# Altium schematic sheet PROC099A_XDS110 Interface_1B.SchDoc: XDS110 Interface_1B
size 431 x 279 mm; Date: Not shown in title block; ApprovedBy: Not shown in title block; CheckedBy: Not shown in title block; Author: Not shown in title block; CompanyName: Not shown in title block; DrawnBy: Adrian Ozer; Engineer: Not shown in title block; Organization: Not shown in title block; Address1: Not shown in title block; Address2: Not shown in title block; Address3: Not shown in title block; Address4: Not shown in title block; DocumentNumber: 13; Revision: Use project parameter SCH_Rev; SheetNumber: 13; SheetTotal: 16; PageSetup: Record=PageOptions|CenterHorizontal=True|CenterVertical=True|PrintScale=1.00|XCorrection=1.00|YCorrection=1.00|PrintKind=0|BorderSize=5000000|LeftOffset=0|BottomOffset=0|Orientation=2|PaperLength=1000|PaperWidth=1000|Scale=100|PaperSource=15|PrintQuality=600|MediaType=1|DitherType=10|PaperKind=Letter|PrintScaleMode=1; CurrentTime: Not shown in title block; CurrentDate: Not shown in title block; Time: Not shown in title block; DocumentFullPathAndName: Not shown in title block; DocumentName: Not shown in title block; ModifiedDate: Not shown in title block; ImagePath: Not shown in title block
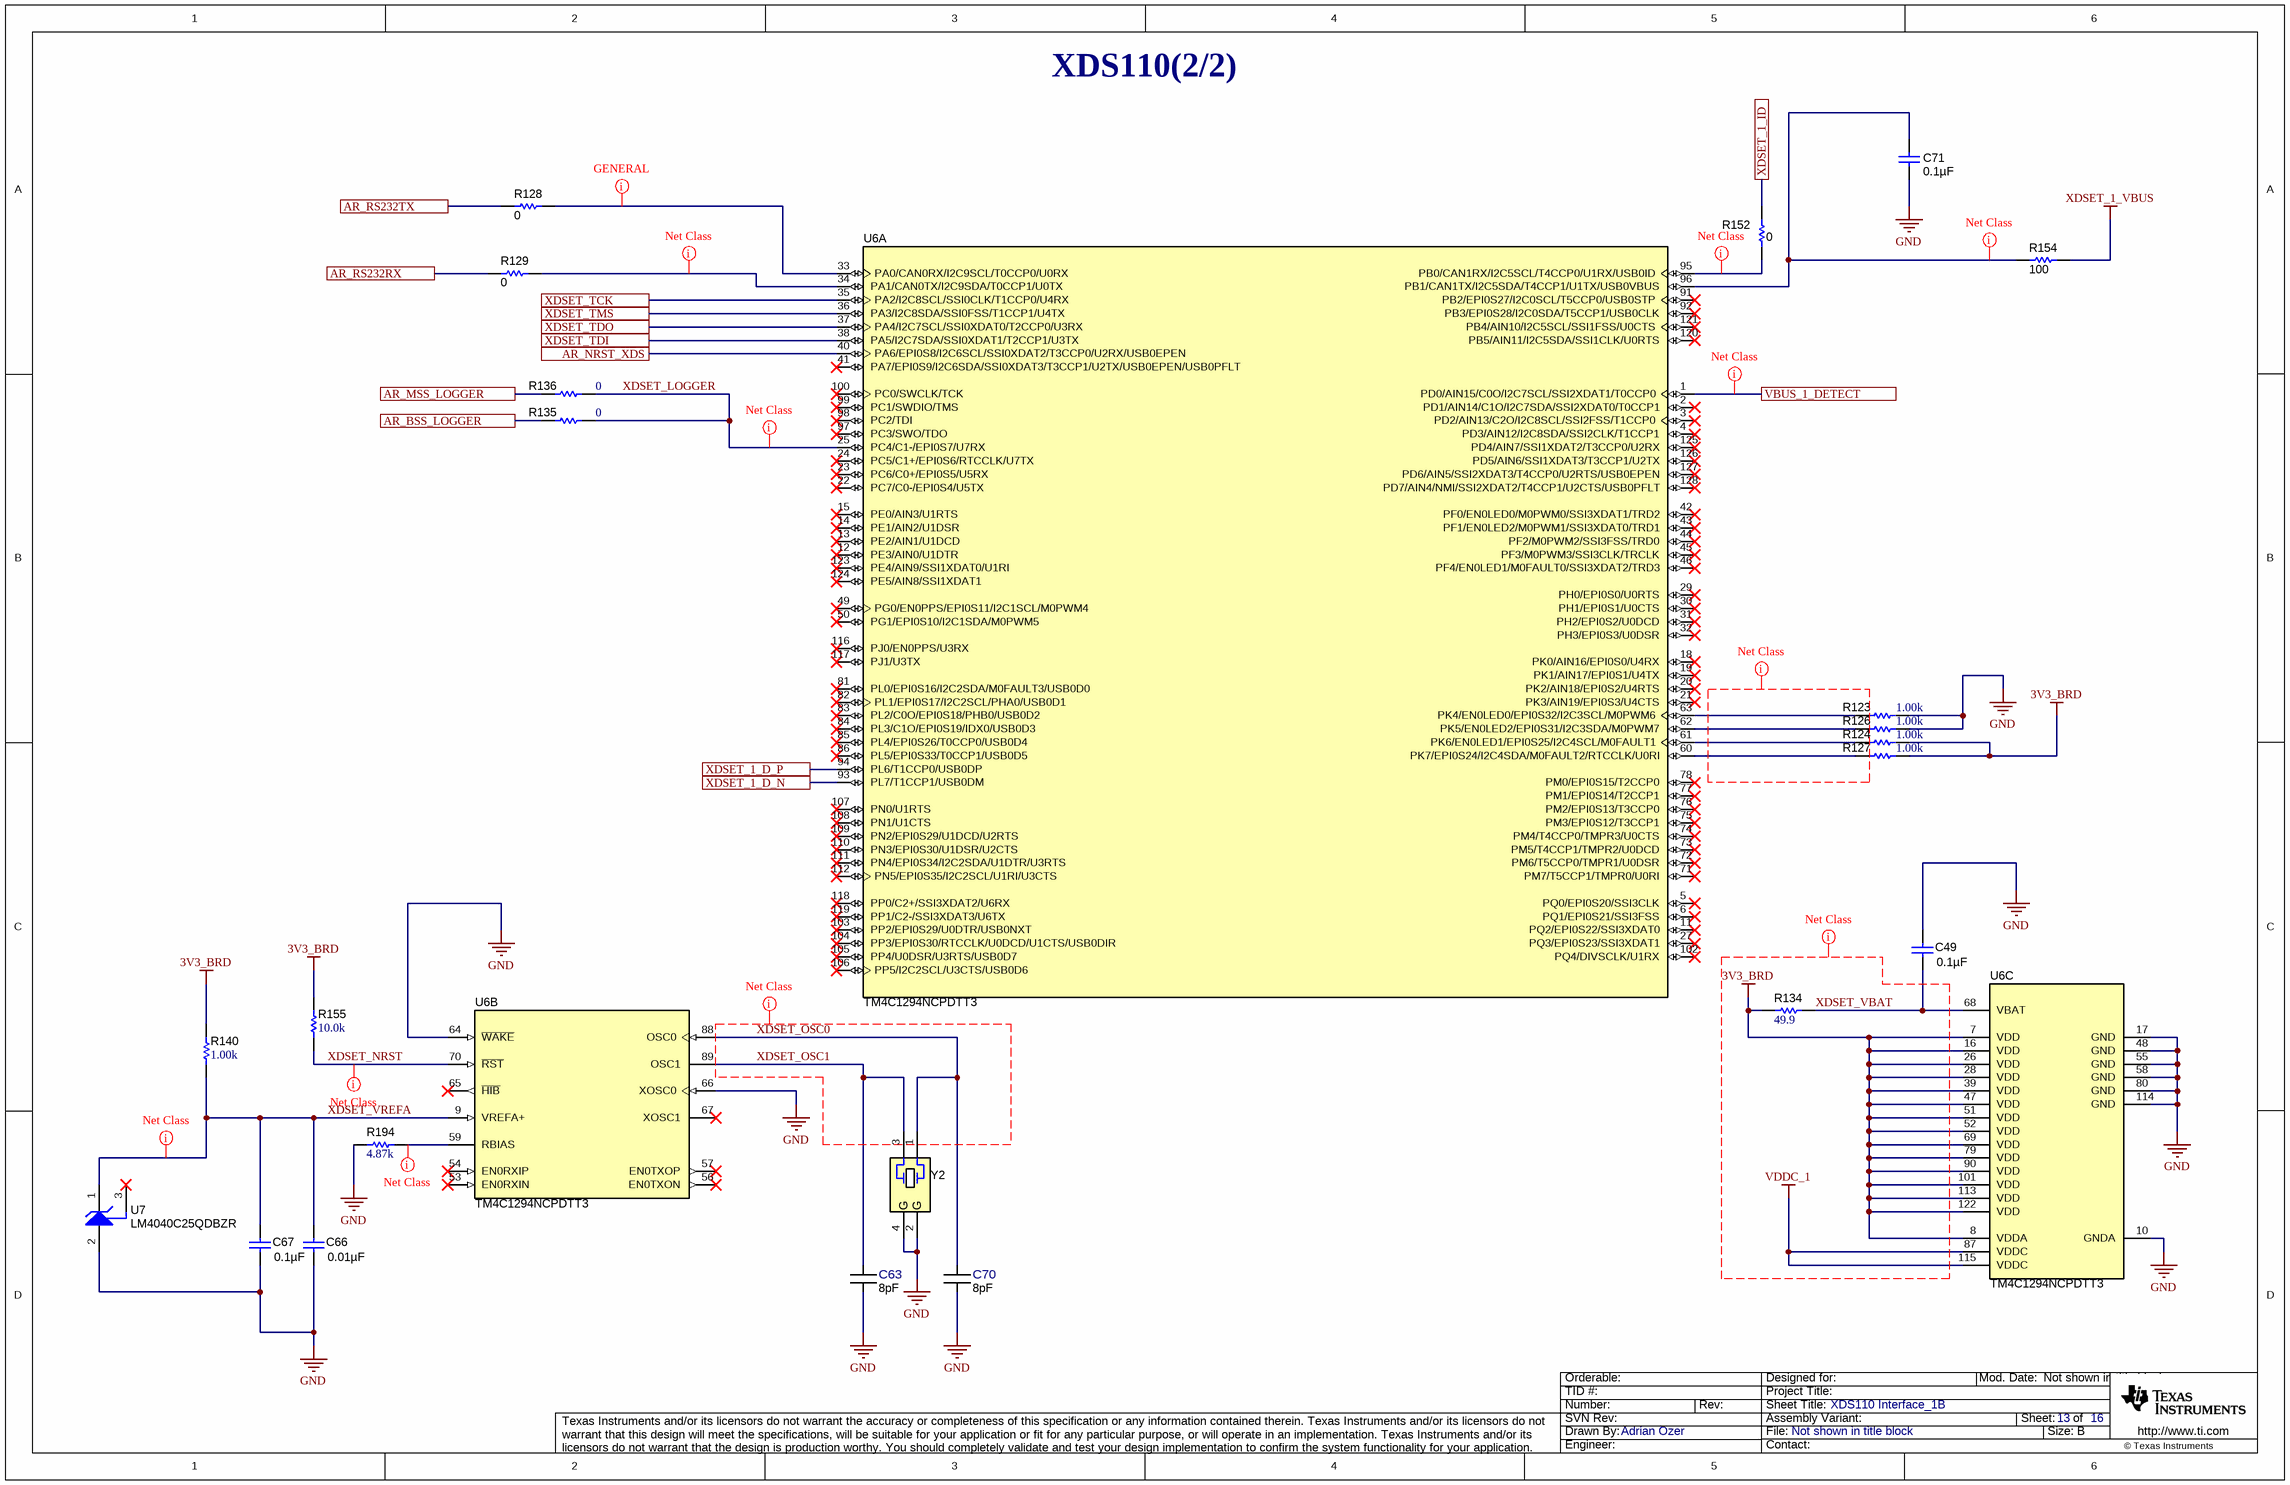
[diagram p0: PROC099A_XDS110 Interface_1B.SchDoc]

## Parts
C49  ValueDisplayed: 0.1µF  [0402L]  (hidden comment: C0402C104K8RACTU)
C63  Cap_F: 8pF  [FP-GCM1555C1H8R0DA16_0402-MFG]  (hidden comment: GCM1555C1H8R0DA16D)
C66  ValueDisplayed: 0.01µF  [0402L]  (hidden comment: C0402C103K4RACTU)
C67  ValueDisplayed: 0.1µF  [0402L]  (hidden comment: C0402C104K8RACTU)
C70  Cap_F: 8pF  [FP-GCM1555C1H8R0DA16_0402-MFG]  (hidden comment: GCM1555C1H8R0DA16D)
C71  ValueDisplayed: 0.1µF  [0402L]  (hidden comment: C0402C104K8RACTU)
R123  ValueDisplayed: 1.00k  [0402L]  (hidden comment: CRCW04021K00FKED)
R124  ValueDisplayed: 1.00k  [0402L]  (hidden comment: CRCW04021K00FKED)
R126  ValueDisplayed: 1.00k  [0402L]  (hidden comment: CRCW04021K00FKED)
R127  ValueDisplayed: 1.00k  [0402L]  (hidden comment: CRCW04021K00FKED)
R128  ValueDisplayed: 0  [0402L]  (hidden comment: ERJ-2GE0R00X)
R129  ValueDisplayed: 0  [0402L]  (hidden comment: ERJ-2GE0R00X)
R134  ValueDisplayed: 49.9  [0402L]  (hidden comment: CRCW040249R9FKED)
R135  ValueDisplayed: 0  [0201_Silk]  (hidden comment: CRCW02010000Z0ED)
R136  ValueDisplayed: 0  [0201_Silk]  (hidden comment: CRCW02010000Z0ED)
R140  ValueDisplayed: 1.00k  [0402L]  (hidden comment: CRCW04021K00FKED)
R152  ValueDisplayed: 0  [0402L]  (hidden comment: ERJ-2GE0R00X)
R154  ValueDisplayed: 100  [0402L]  (hidden comment: ERJ-2GEJ101X)
R155  ValueDisplayed: 10.0k  [0402L]  (hidden comment: CRCW040210K0FKED)
R194  ValueDisplayed: 4.87k  [0402L]  (hidden comment: CRCW04024K87FKED)
U6  TM4C1294NCPDTT3  [PDT0128A]  (parts A,B,C of 3)
U7  LM4040C25QDBZR  [DBZ0003A_N]
Y2  NX3225SA-16.000M-STD-CRS-2  [NDK_NX3225SA]  (value not drawn)

## Ports
AR_BSS_LOGGER, AR_MSS_LOGGER, AR_NRST_XDS, AR_RS232RX, AR_RS232TX, VBUS_1_DETECT, XDSET_1_D_N, XDSET_1_D_P, XDSET_1_ID, XDSET_TCK, XDSET_TDI, XDSET_TDO, XDSET_TMS

## Nets
3V3_BRD: R124.2 R127.2 R134.2 R140.2 R155.2 U6.7(VDD) U6.8(VDDA) U6.16(VDD) U6.26(VDD) U6.28(VDD) U6.39(VDD) U6.47(VDD) U6.51(VDD) U6.52(VDD) U6.69(VDD) U6.79(VDD) U6.90(VDD) U6.101(VDD) U6.113(VDD) U6.122(VDD)
GND: C49.1 C63.2 C66.1 C67.1 C70.2 C71.1 R123.2 R126.2 R194.1 U6.10(GNDA) U6.17(GND) U6.48(GND) U6.55(GND) U6.58(GND) U6.64(~{WAKE}) U6.66(XOSC0) U6.80(GND) U6.114(GND) U7.2(ANODE) Y2.2(GND) Y2.4(GND)
VDDC_1: U6.87(VDDC) U6.115(VDDC)
XDSET_1_VBUS: R154.2
AR_BSS_LOGGER: R135.1 ; port AR_BSS_LOGGER
AR_MSS_LOGGER: R136.1 ; port AR_MSS_LOGGER
AR_NRST_XDS: U6.40(PA6/EPI0S8/I2C6SCL/SSI0XDAT2/T3CCP0/U2RX/USB0EPEN) ; port AR_NRST_XDS
AR_RS232RX: R129.1 ; port AR_RS232RX
AR_RS232TX: R128.1 ; port AR_RS232TX
VBUS_1_DETECT: U6.1(PD0/AIN15/C0O/I2C7SCL/SSI2XDAT1/T0CCP0) ; port VBUS_1_DETECT
XDSET_1_D_N: U6.93(PL7/T1CCP1/USB0DM) ; port XDSET_1_D_N
XDSET_1_D_P: U6.94(PL6/T1CCP0/USB0DP) ; port XDSET_1_D_P
XDSET_1_ID: R152.2 ; port XDSET_1_ID
XDSET_LOGGER: R135.2 R136.2 U6.25(PC4/C1-/EPI0S7/U7RX)
XDSET_NRST: R155.1 U6.70(~{RST})
XDSET_OSC0: C70.1 U6.88(OSC0) Y2.1
XDSET_OSC1: C63.1 U6.89(OSC1) Y2.3
XDSET_TCK: U6.35(PA2/I2C8SCL/SSI0CLK/T1CCP0/U4RX) ; port XDSET_TCK
XDSET_TDI: U6.38(PA5/I2C7SDA/SSI0XDAT1/T2CCP1/U3TX) ; port XDSET_TDI
XDSET_TDO: U6.37(PA4/I2C7SCL/SSI0XDAT0/T2CCP0/U3RX) ; port XDSET_TDO
XDSET_TMS: U6.36(PA3/I2C8SDA/SSI0FSS/T1CCP1/U4TX) ; port XDSET_TMS
XDSET_VBAT: C49.2 R134.1 U6.68(VBAT)
XDSET_VREFA: C66.2 C67.2 R140.1 U6.9(VREFA+) U7.1(CATHODE)
NetC71_2: C71.2 R154.1 U6.96(PB1/CAN1TX/I2C5SDA/T4CCP1/U1TX/USB0VBUS)
NetR123_1: R123.1 U6.63(PK4/EN0LED0/EPI0S32/I2C3SCL/M0PWM6)
NetR124_1: R124.1 U6.61(PK6/EN0LED1/EPI0S25/I2C4SCL/M0FAULT1)
NetR126_1: R126.1 U6.62(PK5/EN0LED2/EPI0S31/I2C3SDA/M0PWM7)
NetR127_1: R127.1 U6.60(PK7/EPI0S24/I2C4SDA/M0FAULT2/RTCCLK/U0RI)
NetR128_2: R128.2 U6.33(PA0/CAN0RX/I2C9SCL/T0CCP0/U0RX)
NetR129_2: R129.2 U6.34(PA1/CAN0TX/I2C9SDA/T0CCP1/U0TX)
NetR152_1: R152.1 U6.95(PB0/CAN1RX/I2C5SCL/T4CCP0/U1RX/USB0ID)
NetR194_2: R194.2 U6.59(RBIAS)

Not connected (* = marked no-connect by the designer): U6 2(PD1/AIN14/C1O/I2C7SDA/SSI2XDAT0/T0CCP1)* 3(PD2/AIN13/C2O/I2C8SCL/SSI2FSS/T1CCP0)* 4(PD3/AIN12/I2C8SDA/SSI2CLK/T1CCP1)* 5(PQ0/EPI0S20/SSI3CLK)* 6(PQ1/EPI0S21/SSI3FSS)* 11(PQ2/EPI0S22/SSI3XDAT0)* 12(PE3/AIN0/U1DTR)* 13(PE2/AIN1/U1DCD)* 14(PE1/AIN2/U1DSR)* 15(PE0/AIN3/U1RTS)* 18(PK0/AIN16/EPI0S0/U4RX)* 19(PK1/AIN17/EPI0S1/U4TX)* 20(PK2/AIN18/EPI0S2/U4RTS)* 21(PK3/AIN19/EPI0S3/U4CTS)* 22(PC7/C0-/EPI0S4/U5TX)* 23(PC6/C0+/EPI0S5/U5RX)* 24(PC5/C1+/EPI0S6/RTCCLK/U7TX)* 27(PQ3/EPI0S23/SSI3XDAT1)* 29(PH0/EPI0S0/U0RTS)* 30(PH1/EPI0S1/U0CTS)* 31(PH2/EPI0S2/U0DCD)* 32(PH3/EPI0S3/U0DSR)* 41(PA7/EPI0S9/I2C6SDA/SSI0XDAT3/T3CCP1/U2TX/USB0EPEN/USB0PFLT)* 42(PF0/EN0LED0/M0PWM0/SSI3XDAT1/TRD2)* 43(PF1/EN0LED2/M0PWM1/SSI3XDAT0/TRD1)* 44(PF2/M0PWM2/SSI3FSS/TRD0)* 45(PF3/M0PWM3/SSI3CLK/TRCLK)* 46(PF4/EN0LED1/M0FAULT0/SSI3XDAT2/TRD3)* 49(PG0/EN0PPS/EPI0S11/I2C1SCL/M0PWM4)* 50(PG1/EPI0S10/I2C1SDA/M0PWM5)* 53(EN0RXIN)* 54(EN0RXIP)* 56(EN0TXON)* 57(EN0TXOP)* 65(~{HIB})* 67(XOSC1)* 71(PM7/T5CCP1/TMPR0/U0RI)* 72(PM6/T5CCP0/TMPR1/U0DSR)* 73(PM5/T4CCP1/TMPR2/U0DCD)* 74(PM4/T4CCP0/TMPR3/U0CTS)* 75(PM3/EPI0S12/T3CCP1)* 76(PM2/EPI0S13/T3CCP0)* 77(PM1/EPI0S14/T2CCP1)* 78(PM0/EPI0S15/T2CCP0)* 81(PL0/EPI0S16/I2C2SDA/M0FAULT3/USB0D0)* 82(PL1/EPI0S17/I2C2SCL/PHA0/USB0D1)* 83(PL2/C0O/EPI0S18/PHB0/USB0D2)* 84(PL3/C1O/EPI0S19/IDX0/USB0D3)* 85(PL4/EPI0S26/T0CCP0/USB0D4)* 86(PL5/EPI0S33/T0CCP1/USB0D5)* 91(PB2/EPI0S27/I2C0SCL/T5CCP0/USB0STP)* 92(PB3/EPI0S28/I2C0SDA/T5CCP1/USB0CLK)* 97(PC3/SWO/TDO)* 98(PC2/TDI)* 99(PC1/SWDIO/TMS)* 100(PC0/SWCLK/TCK)* 102(PQ4/DIVSCLK/U1RX)* 103(PP2/EPI0S29/U0DTR/USB0NXT)* 104(PP3/EPI0S30/RTCCLK/U0DCD/U1CTS/USB0DIR)* 105(PP4/U0DSR/U3RTS/USB0D7)* 106(PP5/I2C2SCL/U3CTS/USB0D6)* 107(PN0/U1RTS)* 108(PN1/U1CTS)* 109(PN2/EPI0S29/U1DCD/U2RTS)* 110(PN3/EPI0S30/U1DSR/U2CTS)* 111(PN4/EPI0S34/I2C2SDA/U1DTR/U3RTS)* 112(PN5/EPI0S35/I2C2SCL/U1RI/U3CTS)* 116(PJ0/EN0PPS/U3RX)* 117(PJ1/U3TX)* 118(PP0/C2+/SSI3XDAT2/U6RX)* 119(PP1/C2-/SSI3XDAT3/U6TX)* 120(PB5/AIN11/I2C5SDA/SSI1CLK/U0RTS)* 121(PB4/AIN10/I2C5SCL/SSI1FSS/U0CTS)* 123(PE4/AIN9/SSI1XDAT0/U1RI)* 124(PE5/AIN8/SSI1XDAT1)* 125(PD4/AIN7/SSI1XDAT2/T3CCP0/U2RX)* 126(PD5/AIN6/SSI1XDAT3/T3CCP1/U2TX)* 127(PD6/AIN5/SSI2XDAT3/T4CCP0/U2RTS/USB0EPEN)* 128(PD7/AIN4/NMI/SSI2XDAT2/T4CCP1/U2CTS/USB0PFLT)*; U7 3(NC)*

## Layout directives
net class GENERAL: (no net found under the mark), NetC71_2, NetR129_2, NetR152_1, NetR194_2, VBUS_1_DETECT, XDSET_LOGGER, XDSET_NRST
net class PWR: 3V3_BRD, VDDC_1, XDSET_VBAT, XDSET_VREFA
net class CLK: XDSET_OSC0, XDSET_OSC1
net class Undefined: NetR128_2

## Notes on the sheet
- XDS110(2/2)
- Drawn By:
- SVN Rev:
- Number:
- TID #:
- Orderable:
- Rev:
- Sheet Title:
- File:
- Project Title:
- Designed for:
- Assembly Variant:
- Mod. Date:
- Sheet:
- Size:
- of
- B
- http://www.ti.com
- Texas Instruments and/or its licensors do not warrant the accuracy or completeness of this specification or any information contained therein. Texas Instruments and/or its licensors do not warrant that this design will meet the specifications, will be suitable for your application or fit for any particular purpose, or will operate in an implementation. Texas Instruments and/or its licensors do not warrant that the design is production worthy. You should completely validate and test your design implementation to confirm the system functionality for your application.
- Engineer:
- Contact:
- © Texas Instruments
- (in symbol CMP-0078214-2) G

## Library data of the parts
C49 = CMP-0078241-1: CAP, CERM, 0.1 µF, 10 V,+/- 10%, X7R, 0402; Manufacturer: Kemet; TaMin_C: -55°C; Polarized: N; SizeAreaWB_mm2: 3; U/M: EA; Value: 0.1uF; TaMax_C: 125°C; SizeZ_mm: 0.6; SizeX_mm: 1; SizeY_mm: 0.5; Cap_Case: 0402; Value2: 10V; CompType: Capacitor; Cap_F: 100nF; AEC Category: Q200; ComponentLink1URL: https://content.kemet.com/datasheets/KEM_C1002_X7R_SMD.pdf; Supplier Part Number 2: 68X2393; Supplier 2: Newark; Supplier Part Number 3: 80-C0402C104K8R; TempCo: X7R; Supplier 3: Mouser; RoHS: Y; MountType: SMT; Supplier 1: Digi-Key; PackageReference: 0402; Tolerance_%: 10%; SizeArea_mm2: 0.5; PartNumber: C0402C104K8RACTU; AEC Qualified: N; VDC_V: 10V; ComponentLink1Description: Datasheet link; AEC Grade: N/A; Supplier Part Number 1: 399-3520-1-ND; Technology: Ceramic
C63 C70 = CMP-0087060-2: Cap Ceramic 8pF 50V C0G 0.5pF SMD 0402 125C Paper T/R; Manufacturer: Murata Electronics North America; TempCo: 30ppm/°C; AEC Qualified: Yes; Symbol Name: SYM-GCM1555C1H8R0DA16D; AEC Grade: Grade 1; SizeZ_mm: 0.55mm; PackageReference: 0402; ComponentLink1URL: https://search.murata.co.jp/Ceramy/image/img/A01X/G101/ENG/GCM1555C1H8R0DA16-01.pdf; ComponentLink1Description: Datasheet; RoHS: TRUE; PartNumber: GCM1555C1H8R0DA16D
C66 = CMP-0078218-1: CAP, CERM, 0.01 µF, 16 V,+/- 10%, X7R, 0402; Manufacturer: Kemet; TaMin_C: -55°C; Polarized: N; Green_Lifecycle: Active; SizeAreaWB_mm2: 3; Green_REACh: Passed; U/M: EA; Value: 0.01uF; TaMax_C: 125°C; SizeZ_mm: 0.6; SizeX_mm: 1; SizeY_mm: 0.5; Cap_Case: 0402; Value2: 16V; Cap_F: 10nF; AEC Category: Q200; ComponentLink1URL: https://content.kemet.com/datasheets/KEM_C1002_X7R_SMD.pdf; Supplier Part Number 2: 66W8706; Supplier 2: Newark; Supplier Part Number 3: 80-C0402C103K4R; TempCo: X7R; Supplier 3: Mouser; RoHS: Y; MountType: SMT; Green_EU RoHS-2: Passed; Supplier 1: Digi-Key; Green_EU RoHS: Passed; PackageReference: 0402; Tolerance_%: 10%; SizeArea_mm2: 0.5; CompType: Capacitor; PartNumber: C0402C103K4RACTU; AEC Qualified: N; VDC_V: 16V; ComponentLink1Description: Datasheet link; AEC Grade: N/A; Supplier Part Number 1: 399-1038-1-ND; Technology: Ceramic
C67 C71 = CMP-0078241-1: CAP, CERM, 0.1 µF, 10 V,+/- 10%, X7R, 0402; Manufacturer: Kemet; TaMin_C: -55°C; Polarized: N; SizeAreaWB_mm2: 3; U/M: EA; Value: 0.1uF; TaMax_C: 125°C; SizeZ_mm: 0.6; SizeX_mm: 1; SizeY_mm: 0.5; Cap_Case: 0402; Value2: 10V; Cap_F: 100nF; AEC Category: Q200; ComponentLink1URL: https://content.kemet.com/datasheets/KEM_C1002_X7R_SMD.pdf; Supplier Part Number 2: 68X2393; Supplier 2: Newark; Supplier Part Number 3: 80-C0402C104K8R; TempCo: X7R; Supplier 3: Mouser; RoHS: Y; MountType: SMT; Supplier 1: Digi-Key; PackageReference: 0402; Tolerance_%: 10%; SizeArea_mm2: 0.5; CompType: Capacitor; PartNumber: C0402C104K8RACTU; AEC Qualified: N; VDC_V: 10V; ComponentLink1Description: Datasheet link; AEC Grade: N/A; Supplier Part Number 1: 399-3520-1-ND; Technology: Ceramic
R123 R124 R126 R127 R140 = CMP-0026071-3: RES, 1.00 k, 1%, 0.063 W, AEC-Q200 Grade 0, 0402; Manufacturer: Vishay-Dale; Power_W: 63mW; TempCo: 100 ppm/C; Value_Code: 1k00; Value: 1.00k; EIA_Code: E96; Res_ohm: 1k; SizeX_mm: 1; SizeY_mm: 0.5; SizeZ_mm: 0.6; Value2: 0.063W; AEC Qualified: Y; VDC_V: 50V; AEC Category: Q200; AEC Grade: 0; Supplier Part Number 2: 52K6545; Supplier 2: Newark; Supplier Part Number 3: 71-CRCW0402-1.0K-E3; Supplier 3: Mouser; RoHS: E; Value1: 1%; MountType: SMT; Supplier 1: Digi-Key; PackageReference: 0402; Tolerance_%: 1%; SizeArea_mm2: 0.5; CompType: Resistor; PartNumber: CRCW04021K00FKED; ComponentLink1Description: Datasheet link; Supplier Part Number 1: 541-1.00KLCT-ND; Technology: Thick Film; ComponentLink1URL: http://www.vishay.com/docs/20035/dcrcwe3.pdf
R128 R129 R152 = CMP-0026992-2: RES, 0, 5%, 0.063 W, 0402; Manufacturer: Panasonic; Power_W: 63mW; TempCo: 600 ppm/C; Value_Code: 0000; U/M: EA; Value: 0; EIA_Code: E24; SizeX_mm: 1; SizeY_mm: 0.5; SizeZ_mm: 0.6; Value2: 0.063W; VDC_V: 50V; AEC Category: Q200; Supplier Part Number 2: 65T8307; Publisher: Texas Instruments; Supplier 2: Newark; Supplier Part Number 3: 667-ERJ-2GE0R00X; Supplier 3: Mouser; Published: 2008-06-26; RoHS: Y; Value1: 5%; MountType: SMT; Supplier 1: Digi-Key; PackageReference: 0402; Tolerance_%: 5%; Res_ohm: 0; SizeArea_mm2: 0.5; CompType: Resistor; LatestRevisionDate: 2017-03-09; PartNumber: ERJ-2GE0R00X; AEC Qualified: ?; ComponentLink1Description: Datasheet link; Supplier Part Number 1: P0.0JCT-ND; Technology: Thick Film; ComponentLink1URL: http://www.panasonic.com/industrial/components/pdf/AOA0000CE1.pdf
R134 = CMP-0026404-2: RES, 49.9, 1%, 0.063 W, AEC-Q200 Grade 0, 0402; Manufacturer: Vishay-Dale; Power_W: 63mW; TempCo: 100 ppm/C; Value_Code: 49R9; Value: 49.9; EIA_Code: E96; SizeX_mm: 1; SizeY_mm: 0.5; SizeZ_mm: 0.6; Value2: 0.063W; AEC Qualified: Y; VDC_V: 50V; AEC Category: Q200; AEC Grade: 0; ComponentLink1URL: http://www.vishay.com/docs/20035/dcrcwe3.pdf; Supplier Part Number 2: 52K7114; Supplier 2: Newark; Supplier Part Number 3: 71-CRCW0402-49.9-E3; Supplier 3: Mouser; RoHS: E; Value1: 1%; MountType: SMT; Supplier 1: Digi-Key; PackageReference: 0402; Tolerance_%: 1%; Res_ohm: 49.9; SizeArea_mm2: 0.5; CompType: Resistor; PartNumber: CRCW040249R9FKED; ComponentLink1Description: Datasheet link; Supplier Part Number 1: 541-49.9LCT-ND; Technology: Thick Film
R135 R136 = CMP-0027008-4: RES, 0, 5%, 0.05 W, 0201; Manufacturer: Vishay-Dale; Power_W: 50mW; TempCo: ppm/C; Value_Code: 0000; Value: 0; EIA_Code: E24; SizeX_mm: 0.6; SizeY_mm: 0.3; SizeZ_mm: 0.26; Value2: 0.05W; SizeArea_mm2: 0.18; AEC Qualified: N; AEC Category: Q200; RoHS: E; Value1: 5%; MountType: SMT; Supplier 1: Newark; PackageReference: 0201; Tolerance_%: 5%; Res_ohm: 0; CompType: Resistor; PartNumber: CRCW02010000Z0ED; ComponentLink1Description: Datasheet link; AEC Grade: N/A; Supplier Part Number 1: 72M6743; Technology: Thick Film; ComponentLink1URL: http://www.vishay.com/docs/20052/crcw0201e3.pdf
R154 = CMP-0026993-2: RES, 100, 5%, 0.1 W, AEC-Q200 Grade 0, 0402; Manufacturer: Panasonic; Power_W: 100mW; TempCo: 200 ppm/C; Value_Code: 100R; U/M: EA; Value: 100; EIA_Code: E24; SizeX_mm: 1; SizeY_mm: 0.5; SizeZ_mm: 0.6; Value2: 0.1W; AEC Qualified: Y; AEC Grade: 0; AEC Category: Q200; Supplier Part Number 2: 65T8246; Publisher: Texas Instruments; Supplier 2: Newark; Supplier Part Number 3: 2059210; Supplier 3: Farnell; Published: 2008-06-26; RoHS: Y; Value1: 5%; MountType: SMT; Supplier 1: Digi-Key; PackageReference: 0402; Tolerance_%: 5%; Res_ohm: 100; SizeArea_mm2: 0.5; CompType: Resistor; LatestRevisionDate: 2017-03-09; PartNumber: ERJ-2GEJ101X; ComponentLink1Description: Datasheet link; Supplier Part Number 1: P100JCT-ND; Technology: Thick Film; ComponentLink1URL: https://industrial.panasonic.com/cdbs/www-data/pdf/RDA0000/AOA0000C84.pdf
R155 = CMP-0025958-3: RES, 10.0 k, 1%, 0.063 W, AEC-Q200 Grade 0, 0402; Manufacturer: Vishay-Dale; Power_W: 63mW; TempCo: 100 ppm/C; Value_Code: 10k0; Value: 10.0k; EIA_Code: E96; Res_ohm: 10k; SizeX_mm: 1; SizeY_mm: 0.5; SizeZ_mm: 0.6; Value2: 0.063W; AEC Qualified: Y; VDC_V: 50V; AEC Category: Q200; AEC Grade: 0; Supplier Part Number 2: 52K6595; Supplier 2: Newark; Supplier Part Number 3: 71-CRCW0402-10K-E3; Supplier 3: Mouser; RoHS: E; Value1: 1%; MountType: SMT; Supplier 1: Digi-Key; PackageReference: 0402; Tolerance_%: 1%; SizeArea_mm2: 0.5; CompType: Resistor; PartNumber: CRCW040210K0FKED; ComponentLink1Description: Datasheet link; Supplier Part Number 1: 541-10.0KLCT-ND; Technology: Thick Film; ComponentLink1URL: http://www.vishay.com/docs/20035/dcrcwe3.pdf
R194 = CMP-0026413-2: RES, 4.87 k, 1%, 0.063 W, AEC-Q200 Grade 0, 0402; Manufacturer: Vishay-Dale; Power_W: 63mW; TempCo: 100 ppm/C; Value_Code: 4k87; Value: 4.87k; EIA_Code: E96; SizeX_mm: 1; SizeY_mm: 0.5; SizeZ_mm: 0.6; Value2: 0.063W; AEC Qualified: Y; VDC_V: 50V; AEC Category: Q200; AEC Grade: 0; ComponentLink1URL: http://www.vishay.com/docs/20035/dcrcwe3.pdf; Supplier Part Number 2: 52K7047; Supplier 2: Newark; Supplier Part Number 3: 71-CRCW0402-4.87K-E3; Supplier 3: Mouser; RoHS: E; Value1: 1%; MountType: SMT; Supplier 1: Digi-Key; PackageReference: 0402; Tolerance_%: 1%; Res_ohm: 4.87k; SizeArea_mm2: 0.5; CompType: Resistor; PartNumber: CRCW04024K87FKED; ComponentLink1Description: Datasheet link; Supplier Part Number 1: 541-4.87KLCT-ND; Technology: Thick Film
U6 = CMP-0029856-2: Tiva C Series Microcontroller, 1024 KB Flash, 256 KB SRAM, 12 Bit, 20 Channels, -40 to 105 degC, 128-Pin TQFP (PDT), Green (RoHS & no Sb/Br), Tray; Manufacturer: Texas Instruments; ADC Channels: 20; CPU: ARM Cortex-M4; Flash: 1024 KB; ADC Resolution: 12 Bits; Max Speed: 120 MHz; SRAM: 256 KB; SizeAreaWB_mm2: 324.0; SizeArea_mm2: 256.0; SizeX_mm: 16.0; SizeZ_mm: 1.2; CompType: IC; PackageDescription: 128-Pin Thin Quad Flat Package, Body 14 x 14 mm, Pitch 0.4 mm; Mounting Technology: Surface Mount; ComponentLink3URL: http://www.ti.com/lit/ml/mpqf013/mpqf013.pdf; ComponentLink2Description: Datasheet; Packing: Tray; PartNumber: TM4C1294NCPDTT3; ComponentLink2URL: http://www.ti.com/lit/ds/symlink/tm4c1294ncpdt.pdf; ComponentLink1URL: http://www.ti.com/; PackageVersion: 4087726/A; ComponentLink3Description: Package Specification; DatasheetVersion: 15863.2743; ComponentLink1Description: Manufacturer URL; PackageReference: PDT0128A; Temperature Range: -40 to 105 degC; Eco-Plan: Green (RoHS & no Sb/Br); SizeY_mm: 16.0; MountType: SMT; PartId: 1
U7 = CMP-0033001-1: Precision Micropower Shunt Voltage Reference, 0.5% accuracy, 2.5 V, 15 ppm / degC, 15 mA, -40 to 125 degC, 3-pin SOT-23 (DBZ), Green (RoHS & no Sb/Br); Manufacturer: Texas Instruments; Initial Accuracy @ 25/deg C(%): 0.5; Temp Coeff(Typ)(ppm/ degree C): 15; Temp Coeff(Max)(ppm/ degree C): 100; Rating: Catalog; Min Iz for Regulation(uA): 75; VO(V): 2.5; PackageDescription: 3-Pin Plastic Small Outline, Body 2.92 x 1.3 mm, Pitch 0.95 mm; ComponentLink2Description: Datasheet; ComponentLink3Description: Package Specification; Mounting Technology: Surface Mount; Code_JEDEC: TO-236; ComponentLink1Description: Manufacturer URL; ComponentLink2URL: http://www.ti.com/general/docs/lit/getliterature.tsp?genericPartNumber=LM4040C25&fileType=pdf; PackageVersion: 4203227/B; ComponentLink1URL: http://www.ti.com/; SubFamily: Shunt Voltage Reference; ComponentLink3URL: http://www.ti.com/litv/pdf/mpds108a; PartNumber: LM4040C25QDBZR; Iout/Iz(Max)(mA): 15; Eco-Plan: Green (RoHS & no Sb/Br); DatasheetVersion: SLOS456K; PackageReference: DBZ0003A
Y2 = CMP-0078214-2: Crystal, 16 MHz, 15 ppm, 8 pF, AEC-Q200 Grade 1, SMD; Manufacturer: NDK; TaMin_C: -40°C; Frequency Tolerance: 10 ppm; Frequency Stability: 150 ppm; Load Capacitance: 7.36 pF; Frequency_Fixed: 16MHz; TaMax_C: 125°C; AEC Qualified: N; AEC Grade: 1; AEC Category: Q200; ComponentLink1URL: http://www.ndk.com/images/products/catalog/c_NX3225SA-STD-CRS-2_e.pdf; RoHS: Y; MountType: SMT; Supplier 1: Digi-Key; PackageReference: 3.2x0.55x2.5mm; CompType: Crystal; PartNumber: NX3225SA-16.000M-STD-CRS-2; ComponentLink1Description: Datasheet Link; Supplier Part Number 1: 644-1129-1-ND